# EAGLE design Rechargeable battery capacity tester v1a (EAGLE 6.3)
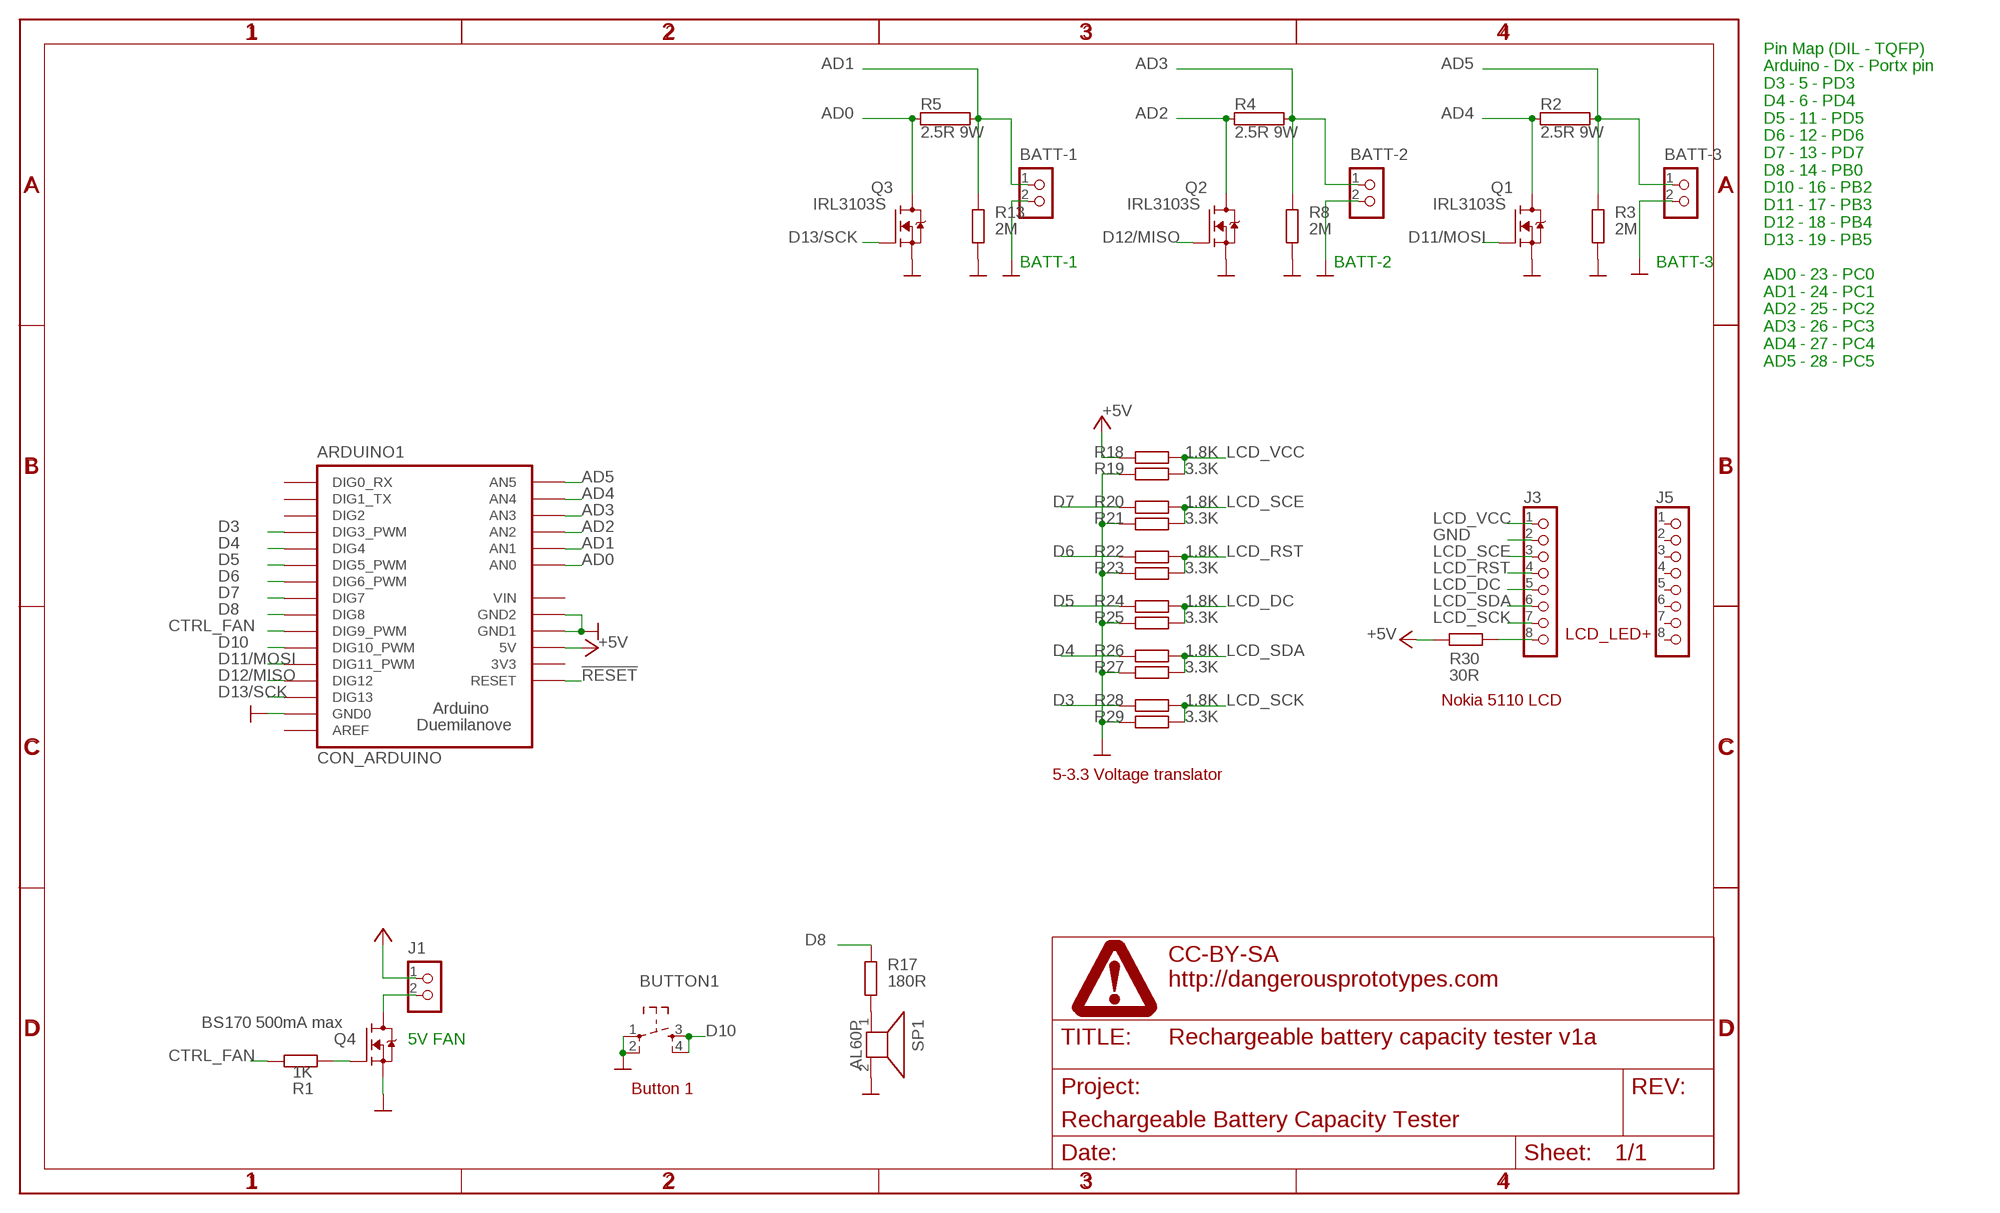
[diagram p0: schematic, sheet 1]

## Parts
ARDUINO1  CON_ARDUINO  [CON_ARDUINO]
BATT-1  CON_TERMINAL_BLOCK_02-5MM  [TERMINAL_BLOCK_2P_5]
BATT-2  CON_TERMINAL_BLOCK_02-5MM  [TERMINAL_BLOCK_2P_5]
BATT-3  CON_TERMINAL_BLOCK_02-5MM  [TERMINAL_BLOCK_2P_5]
BUTTON1  SW_TACT_4P  [SW_TACT_SMALL]
J1  CON_JST_2PIN-PTH  [CON_JST_2PIN]
J3  CON_HEADER_1X08-PTH  [M1X8]
J5  CON_HEADER_1X08-PTH  [M1X8]
Q1  IRL3103S  TRANSISTOR_MOSFET-N-D2PAK  [D2PAK]
Q2  IRL3103S  TRANSISTOR_MOSFET-N-D2PAK  [D2PAK]
Q3  IRL3103S  TRANSISTOR_MOSFET-N-D2PAK  [D2PAK]
Q4  BS170 500mA max  TRANSISTOR_FET_BS170-SOT-23  [SOT-23]
R1  1K  RESISTOR-0603  [R603]
R2  2.5R 9W  RKH214-8  [KH214-8]
R3  2M  RESISTOR-0603  [R603]
R4  2.5R 9W  RKH214-8  [KH214-8]
R5  2.5R 9W  RKH214-8  [KH214-8]
R8  2M  RESISTOR-0603  [R603]
R13  2M  RESISTOR-0603  [R603]
R17  180R  RESISTOR-0603  [R603]
R18  1.8K  RESISTOR-0603  [R603]
R19  3.3K  RESISTOR-0603  [R603]
R20  1.8K  RESISTOR-0603  [R603]
R21  3.3K  RESISTOR-0603  [R603]
R22  1.8K  RESISTOR-0603  [R603]
R23  3.3K  RESISTOR-0603  [R603]
R24  1.8K  RESISTOR-0603  [R603]
R25  3.3K  RESISTOR-0603  [R603]
R26  1.8K  RESISTOR-0603  [R603]
R27  3.3K  RESISTOR-0603  [R603]
R28  1.8K  RESISTOR-0603  [R603]
R29  3.3K  RESISTOR-0603  [R603]
R30  30R  RESISTOR-0603  [R603]
SP1  AL60P  [AL60P]
U$1  FRAME_DINA4_L  [DP_LOGO]

## Nets
!RESET: ARDUINO1.RESET
+5V: ARDUINO1.5V J1.1 R18.1 R30.1 ; supply symbol labelled SUPPLY_+5V
AD0: ARDUINO1.A_0(AN0) Q3.2(D) R5.1
AD1: ARDUINO1.A_1(AN1) BATT-1.1 R5.2 R13.2
AD2: ARDUINO1.A_2(AN2) Q2.2(D) R4.1
AD3: ARDUINO1.A_3(AN3) BATT-2.1 R4.2 R8.2
AD4: ARDUINO1.A_4(AN4) Q1.2(D) R2.1
AD5: ARDUINO1.A_5(AN5) BATT-3.1 R2.2 R3.2
CTRL_FAN: ARDUINO1.D_9(DIG9_PWM) R1.1
D3: ARDUINO1.D_3(DIG3_PWM) R28.1
D4: ARDUINO1.D_4(DIG4) R26.1
D5: ARDUINO1.D_5(DIG5_PWM) R24.1
D6: ARDUINO1.D_6(DIG6_PWM) R22.1
D7: ARDUINO1.D_7(DIG7) R20.1
D8: ARDUINO1.D_8(DIG8) R17.2
D10: ARDUINO1.D_10(DIG10_PWM) BUTTON1.3 BUTTON1.4
D11/MOSI: ARDUINO1.D_11(DIG11_PWM) Q1.1(G)
D12/MISO: ARDUINO1.D_12(DIG12) Q2.1(G)
D13/SCK: ARDUINO1.D_13(DIG13) Q3.1(G)
GND: ARDUINO1.GND0 ARDUINO1.GND1 ARDUINO1.GND2 BATT-1.2 BATT-2.2 BATT-3.2 BUTTON1.1 BUTTON1.2 J3.2 Q1.3(S) Q2.3(S) Q3.3(S) Q4.2(S) R3.1 R8.1 R13.1 R19.1 R21.1 R23.1 R25.1 R27.1 R29.1 SP1.2 ; supply symbol labelled SUPPLY_GND
LCD_DC: J3.5 R24.2 R25.2
LCD_RST: J3.4 R22.2 R23.2
LCD_SCE: J3.3 R20.2 R21.2
LCD_SCK: J3.7 R28.2 R29.2
LCD_SDA: J3.6 R26.2 R27.2
LCD_VCC: J3.1 R18.2 R19.2
N$1: Q4.1(G) R1.2
N$3: J1.2 Q4.3(D)
N$4: J3.8 R30.2
N$7: R17.1 SP1.1
Unconnected: ARDUINO1.3V3 ARDUINO1.AREF ARDUINO1.D_0(DIG0_RX) ARDUINO1.D_1(DIG1_TX) ARDUINO1.D_2(DIG2) J5.1 J5.2 J5.3 J5.4 J5.5 J5.6 J5.7 J5.8

## Notes on the sheet
- BATT-1 | BATT-2 | BATT-3
- Pin Map (DIL - TQFP)
  Arduino - Dx - Portx pin
  D3 - 5 - PD3
  D4 - 6 - PD4
  D5 - 11 - PD5
  D6 - 12 - PD6
  D7 - 13 - PD7
  D8 - 14 - PB0
  D10 - 16 - PB2
  D11 - 17 - PB3
  D12 - 18 - PB4
  D13 - 19 - PB5
  
  AD0 - 23 - PC0
  AD1 - 24 - PC1
  AD2 - 25 - PC2
  AD3 - 26 - PC3
  AD4 - 27 - PC4
  AD5 - 28 - PC5
- LCD_LED+
- Nokia 5110 LCD
- 5-3.3 Voltage translator
- 5V FAN
- Button 1

## Power pins joined to a net without a drawn wire
VIN: ARDUINO1.VIN

## Library data of the parts
ARDUINO1 = dp_devices:CON_ARDUINO: Arduino board connector layout
BATT-1-BATT-3 = dp_devices:CON_TERMINAL_BLOCK_02: 2 poles wire to board terminal block
BUTTON1 = dp_devices:SW_TACT_4P
J1 = dp_devices.v6:CON_JST_2PIN
J3 J5 = dp_devices:CON_HEADER_1X08
Q1-Q3 = dp_devices.v6:TRANSISTOR_MOSFET-N
Q4 = dp_devices.v6:TRANSISTOR_FET_BS170: N-Channel Enhancement Mode Field Effect Transistor
R1 R3 R8 R13 R17-R30 = dp_devices:RESISTOR
R2 R4 R5 = resistor-power:R: Power Resitor; OC_FARNELL: unknown; OC_NEWARK: unknown
SP1 = buzzer:AL60P: SPEAKER Source: Buerklin; OC_FARNELL: unknown; OC_NEWARK: unknown
U$1 = dp_devices:FRAME_DINA4_L: A4 DP frame Standard Dangerous Prototypes schematic frame. Automagically adds the DP logo and standard texts to the PCB Use the atrribute in the schematic editor to change the fields.; FF1: Credits to: http://www.instructables.com/member/BrianH/; LICENSE: CC-BY-SA; PROJECT: Rechargeable Battery Capacity Tester; URL1: http://dangerousprototypes.com; URL2: http://www.instructables.com/id/Rechargeable-Battery-Capacity-Tester/

## Board
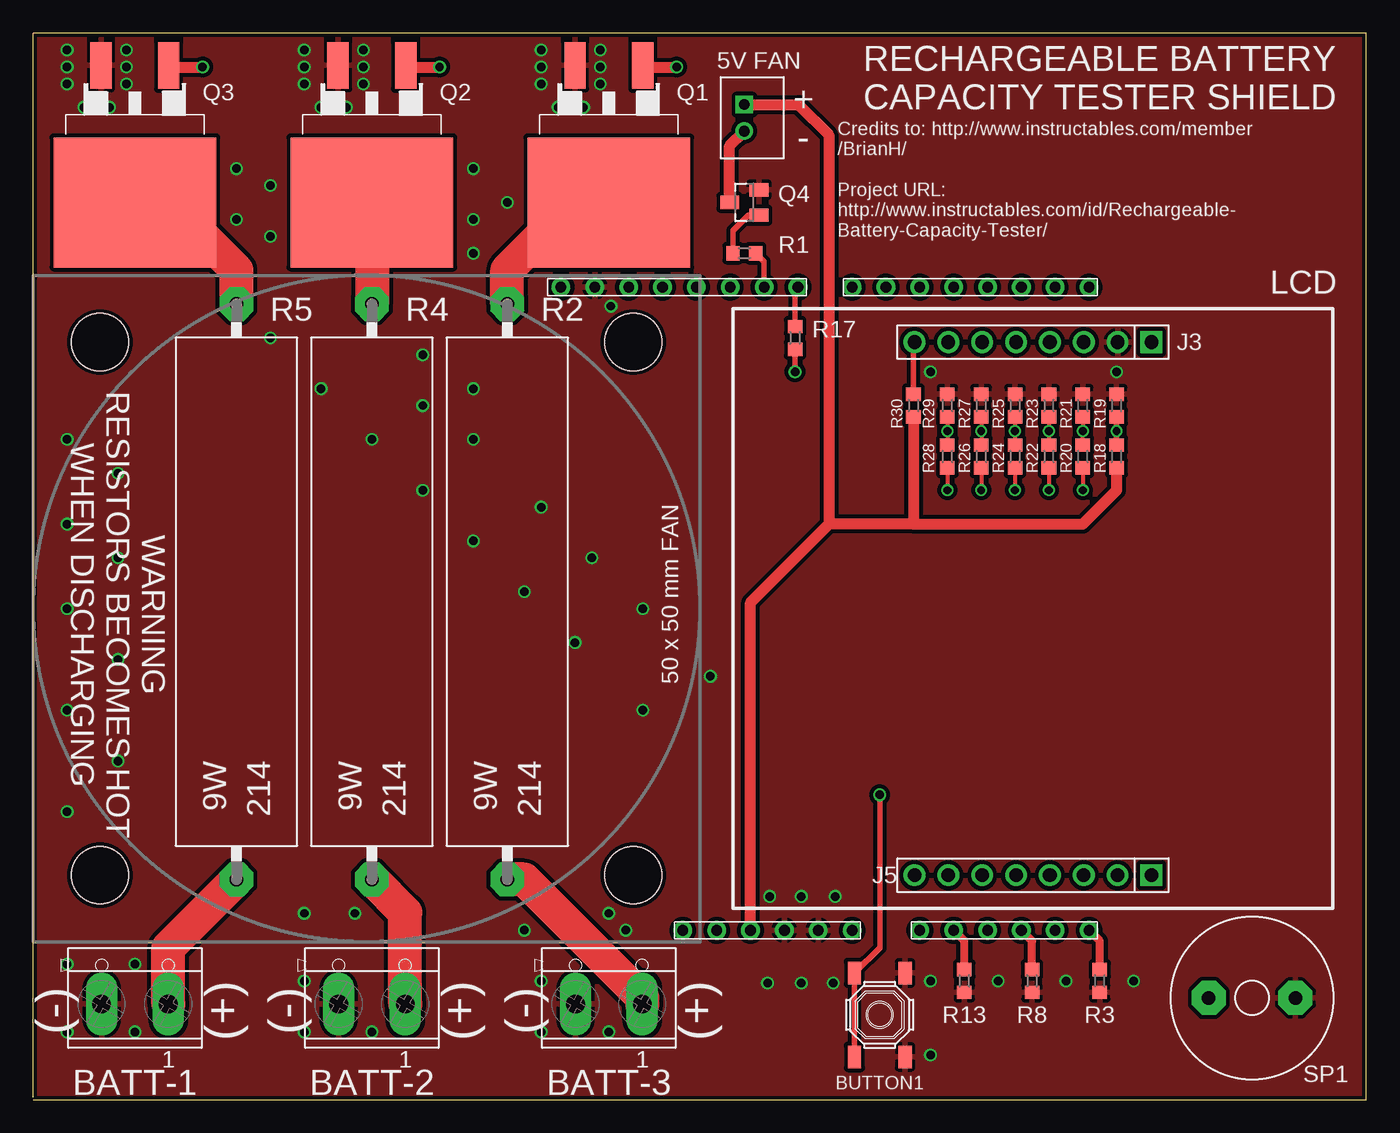
[diagram p1: board, top side]
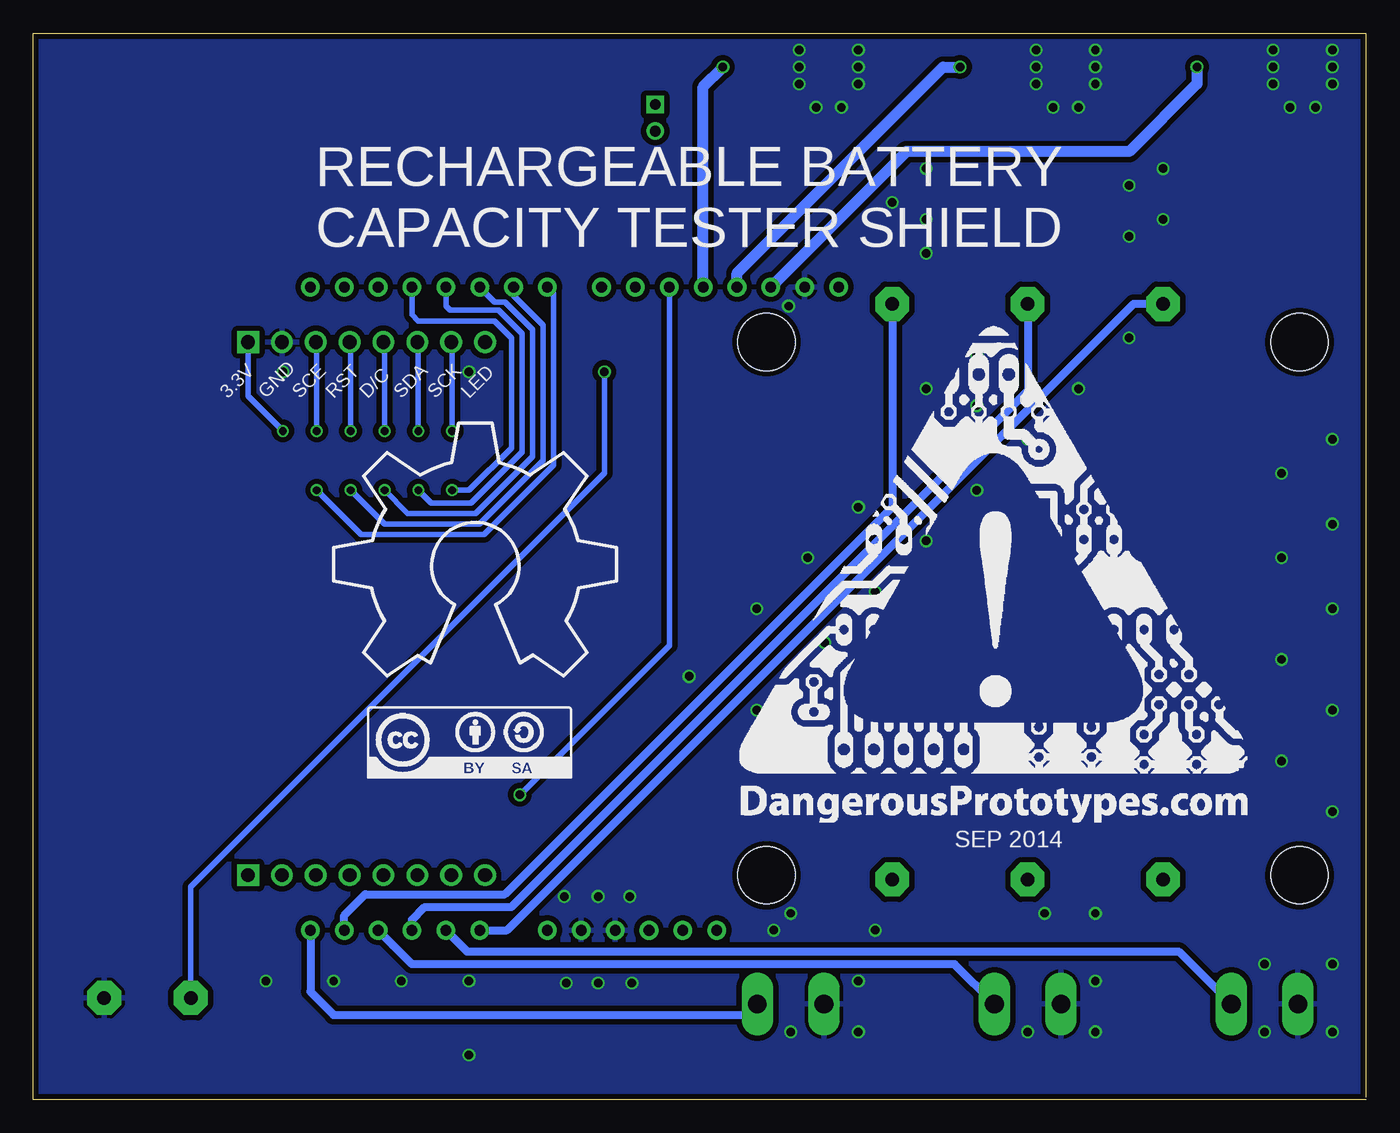
[diagram p2: board, bottom side, seen from below]

Size 100 x 80 mm. Coordinates in mm from the lower left corner, seen from the top.
Outline: 0,0.16 0,80 100,80 100,0 0,0
Copper layers (1*16): Top 0.035mm / dielectric 1.5mm / Bottom 0.035mm
Design rules "dirt_cheap_dirty_boards.v1": minimum track width 5mil, minimum drill 12mil, track to track 5mil, track to pad 5mil, pad to pad 5mil, via to via 5mil, smd to smd 0mil, copper to edge 10mil, drill to drill 10mil, minimum pad ring 10mil, minimum via ring 6mil, stop-mask expansion 2mil, vias tented up to drill 25mil, thermal gap 10mil
Holes 4.3 mm at 5,56.83 5,16.83 45,16.83 45,56.83

### Footprints (pad centres in the part's own frame; a part is rotated, then mirrored left to right if it is on the bottom)
CON_ARDUINO = drill 0.8 pad 1.4: 3V3 25.4,-12.7; 5V 25.4,-10.16; A_0 25.4,2.54; A_1 25.4,5.08; A_2 25.4,7.62; A_3 25.4,10.16; A_4 25.4,12.7; A_5 25.4,15.24; AREF -22.86,-24.384; D_0 -22.86,15.24; D_1 -22.86,12.7; D_2 -22.86,10.16; D_3 -22.86,7.62; D_4 -22.86,5.08; D_5 -22.86,2.54; D_6 -22.86,0; D_7 -22.86,-2.54; D_8 -22.86,-6.604; D_9 -22.86,-9.144; D_10 -22.86,-11.684; D_11 -22.86,-14.224; D_12 -22.86,-16.764; D_13 -22.86,-19.304; GND0 -22.86,-21.844; GND1 25.4,-7.62; GND2 25.4,-5.08; RESET 25.4,-15.24; VIN 25.4,-2.54
TERMINAL_BLOCK_2P_5 = drill 1.4 pad 2.38 long: 1 2.5,-0.45; 2 -2.5,-0.45
SW_TACT_SMALL = smd 1.7 x 1: 1 -3.15,1.9; 2 3.15,1.9; 3 -3.15,-1.9; 4 3.15,-1.9
CON_JST_2PIN = drill 0.8 square: 1 -1,0 | drill 0.8: 2 1,0
M1X8 = drill 1.02 pad 1.632 square: 1 -8.89,0 | drill 1.02 pad 1.632: 2 -6.35,0; 3 -3.81,0; 4 -1.27,0; 5 1.27,0; 6 3.81,0; 7 6.35,0; 8 8.89,0
D2PAK = smd 1.6 x 3.5: 1 -2.54,-10.28; 3 2.54,-10.28 | smd 12.2 x 9.75: 2 0,0
SOT-23 = smd 1 x 1.4: 1 -0.95,-1.1; 2 0.95,-1.1; 3 0,1.1
R603 = smd 1 x 1.1: 1 -0.85,0; 2 0.85,0
KH214-8 = drill 1.016 pad 2.54 octagon: 1 -21.59,0; 2 21.59,0
AL60P = drill 1.016 pad 2.54 octagon: 1 -3.251,0; 2 3.251,0

### Placement (x,y rotation side)
ARDUINO1  63.97,38.1 270 top
BATT-1  7.62,7.62 0 top
BATT-2  25.4,7.62 0 top
BATT-3  43.18,7.62 0 top
BUTTON1  63.5,6.35 270 top
J1  53.34,73.66 270 top
J3  75,56.83 180 top
J5  75,16.83 180 top
Q1  43.18,67.31 180 top
Q2  25.4,67.31 180 top
Q3  7.62,67.31 180 top
Q4  53.34,67.31 90 top
R1  53.34,63.5 180 top
R2  35.56,38.1 270 top
R3  80.01,8.89 90 top
R4  25.4,38.1 270 top
R5  15.24,38.1 270 top
R8  74.93,8.89 90 top
R13  69.85,8.89 90 top
R17  57.15,57.15 90 top
R18  81.27,48.26 90 top
R19  81.27,52.07 270 top
R20  78.73,48.26 90 top
R21  78.73,52.07 270 top
R22  76.19,48.26 90 top
R23  76.19,52.07 270 top
R24  73.65,48.26 90 top
R25  73.65,52.07 270 top
R26  71.11,48.26 90 top
R27  71.11,52.07 270 top
R28  68.57,48.26 90 top
R29  68.57,52.07 270 top
R30  66.03,52.07 90 top
SP1  91.44,7.62 0 top
U$1  0,-8.89 0 top  (outside the outline)
U$2  [DP_LOGO_ART_1.5X1.5]  46.99,20.79 0 bottom
U$3  [LOGO_CC-BY-SA]  74.93,24.13 0 bottom
U$4  [OSHW_10X750_NOTEXT]  77.47,31.75 0 bottom

### Tracks (layer width: path | path; a pad name or v marks a point on that pad's centre or on a via)
+5V
  Top 0.406: R18.1 | 66.03,43.19 66.04,43.18
  Top 0.813: ARDUINO1.5V 53.81,37.3 59.69,43.18 | R18.1 81.28,45.72 78.74,43.18 66.04,43.18 | R30.1 66.03,43.19 59.7,43.19 59.69,43.18 | J1.1 57.42,74.66 59.69,72.39 59.69,43.18
AD0
  Top 2.54: R5.1 15.24,62.23 10.16,67.31 Q3.2
  Bottom 0.61: ARDUINO1.A_0 64.45,12.7 17.46,59.69 R5.1
AD1
  Top 0.61: R13.2 69.85,11.9 ARDUINO1.A_1
  Top 2.54: BATT-1.1 10.12,11.39 R5.2
  Bottom 0.61: ARDUINO1.A_1 67.47,11.11 14.06,11.11 BATT-1.1
AD2
  Top 2.54: Q2.2 R4.1
  Bottom 0.61: ARDUINO1.A_2 71.59,13.5 70.64,14.45 64.14,14.45 25.4,53.18 R4.1
AD3
  Top 0.61: R8.2 74.93,11.9 ARDUINO1.A_3
  Top 2.54: BATT-2.1 27.9,14.01 R4.2
  Bottom 0.61: BATT-2.1 30.89,10.16 71.59,10.16 ARDUINO1.A_3
AD4
  Top 2.54: R2.1 35.56,62.23 40.64,67.31 Q1.2
  Bottom 0.61: ARDUINO1.A_4 76.67,13.82 75.09,15.4 64.61,15.4 35.56,44.45 R2.1
AD5
  Top 0.61: R3.2 80.01,11.9 ARDUINO1.A_5
  Top 2.54: BATT-3.1 45.68,7.66 36.83,16.51 R2.2
  Bottom 0.61: ARDUINO1.A_5 79.21,8.09 77.47,6.35 45.72,6.35 BATT-3.1
CTRL_FAN
  Top 0.406: ARDUINO1.D_9 54.83,62.86 R1.1
D3  (via drill 0.58)
  Top 0.305: R28.1 v68.57,45.72
  Bottom 0.406: ARDUINO1.D_3 71.59,58.89 71.12,58.42 65.41,58.42 64.14,57.15 64.14,48.9 67.31,45.72 v68.57,45.72
D4  (via drill 0.58)
  Top 0.305: R26.1 v71.11,45.72
  Bottom 0.406: ARDUINO1.D_4 69.05,59.52 68.74,59.21 65.09,59.21 63.34,57.47 63.34,48.58 67.15,44.77 70.16,44.77 v71.11,45.72
D5  (via drill 0.58)
  Top 0.305: R24.1 v73.65,45.72
  Bottom 0.406: v73.65,45.72 71.91,43.97 66.83,43.97 62.55,48.26 62.55,57.78 64.61,59.85 65.4,59.85 ARDUINO1.D_5
D6  (via drill 0.58)
  Top 0.305: R22.1 v76.19,45.72
  Bottom 0.406: ARDUINO1.D_6 63.97,60.32 61.75,58.1 61.75,47.94 66.52,43.18 73.65,43.18 v76.19,45.72
D7  (via drill 0.58)
  Top 0.305: R20.1 v78.73,45.72
  Bottom 0.406: ARDUINO1.D_7 60.96,60.48 60.96,47.62 66.2,42.39 75.4,42.39 v78.73,45.72
D8
  Top 0.406: R17.2 57.15,60.74 ARDUINO1.D_8
D10  (via drill 0.64)
  Top 0.406: BUTTON1.4 BUTTON1.3 63.5,11.4 v63.5,22.86
  Bottom 0.406: ARDUINO1.D_10 52.29,34.07 v63.5,22.86
D11/MOSI  (via drill 0.64)
  Top 0.813: Q1.1 45.72,77.47 v48.26,77.47
  Bottom 0.813: ARDUINO1.D_11 49.75,75.98 v48.26,77.47
D12/MISO  (via drill 0.64)
  Top 0.813: Q2.1 27.94,77.47 v30.48,77.47
  Bottom 0.813: ARDUINO1.D_12 47.21,62.01 31.75,77.47 v30.48,77.47
D13/SCK  (via drill 0.64)
  Top 0.813: Q3.1 10.16,77.47 v12.7,77.47
  Bottom 0.813: v12.7,77.47 12.7,76.2 17.78,71.12 34.51,71.12 ARDUINO1.D_13
GND  (via drill 0.64)
  other vias: 20.32,78.74 20.32,77.47 20.32,76.2 21.59,74.45 23.5,74.45 24.77,76.2 24.77,77.47 24.77,78.74 67.31,54.61 81.28,54.61 2.54,78.74 2.54,77.47 2.54,76.2 6.99,78.74 6.99,77.47 6.99,76.2 5.71,74.45 3.81,74.45 38.1,78.74 38.1,77.47 38.1,76.2 39.37,74.45 41.27,74.45 42.55,76.2 42.55,77.47 42.55,78.74 67.31,8.89 67.31,3.33 72.39,8.89 77.47,8.89 82.55,8.89 57.63,15.24 60.17,15.24 55.24,15.24 55.09,8.73 57.63,8.73 60.01,8.73 43.34,59.53 15.24,69.85 17.78,68.58 15.24,66.04 17.78,64.77 33.02,69.85 35.56,67.31 33.02,66.04 33.02,63.5 33.02,53.34 33.02,49.53 29.21,52.07 29.21,55.88 36.83,38.1 33.02,41.91 29.21,45.72 25.4,49.53 21.59,53.34 17.78,57.15 7.62,10.16 2.54,10.16 2.54,5.08 7.62,5.08 20.32,5.08 25.4,5.08 20.32,8.89 20.32,13.97 24.13,13.97 38.1,8.89 38.1,5.08 43.18,5.08 36.83,12.7 44.45,12.7 43.18,13.97 2.54,21.59 6.35,25.4 2.54,29.21 6.35,33.02 2.54,36.83 6.35,40.64 2.54,43.18 6.35,46.99 2.54,49.53 38.1,44.45 41.91,40.64 45.72,36.83 40.64,34.29 45.72,29.21 50.8,31.75
  pour Top (isolate 0.305): 0,80 100,80 100,0 0,0.16
  pour Bottom (isolate 0.406): 0,80 100,80 100,0 0,0.16
LCD_DC  (via drill 0.58)
  Top 0.305: R25.2 v73.65,50.16 R24.2
  Bottom 0.406: v73.65,50.16 73.65,56.75 J3.5
LCD_RST  (via drill 0.58)
  Top 0.305: R23.2 v76.19,50.16 R22.2
  Bottom 0.406: v76.19,50.16 76.19,56.75 J3.4
LCD_SCE  (via drill 0.58)
  Top 0.305: R21.2 v78.73,50.16 R20.2
  Bottom 0.406: v78.73,50.16 78.73,56.75 J3.3
LCD_SCK  (via drill 0.58)
  Top 0.305: R29.2 v68.57,50.16 R28.2
  Bottom 0.406: v68.57,50.16 68.57,56.75 J3.7
LCD_SDA  (via drill 0.58)
  Top 0.305: R27.2 v71.11,50.16 R26.2
  Bottom 0.406: v71.11,50.16 71.11,56.75 J3.6
LCD_VCC  (via drill 0.58)
  Top 0.406: v81.27,50.16 R18.2 81.43,49.27 | R19.2 v81.27,50.16 | v81.27,50.16 81.27,50.48
  Bottom 0.406: J3.1 83.89,52.78 v81.27,50.16
N$1
  Top 0.406: R1.2 52.49,65.19 53.66,66.36 Q4.1
N$3
  Top 0.813: Q4.3 52.24,71.56 J1.2
N$4
  Top 0.406: R30.2 66.03,56.75 J3.8
N$7  (via drill 0.64)
  Top 0.406: R17.1 v57.15,54.61
  Bottom 0.406: v57.15,54.61 57.15,46.99 88.19,15.95 SP1.1

### Text on the board
tPlace: 5V FAN | RECHARGEABLE BATTERY / CAPACITY TESTER SHIELD | + / - | Credits to: http://www.instructables.com/member / /BrianH/ / / Project URL: / http://www.instructables.com/id/Rechargeable- / Battery-Capacity-Tester/ | LCD | 50 x 50 mm FAN | WARNING / RESISTORS BECOMES HOT / WHEN DISCHARGING | (-) | (+) | (-) | (+) | (-) | (+)
bPlace: RECHARGEABLE BATTERY / CAPACITY TESTER SHIELD | LED | SCK | SDA | D/C | RST | SCE | GND | 3.3V | SEP 2014